# EAGLE design 555 (EAGLE 9.5.1)
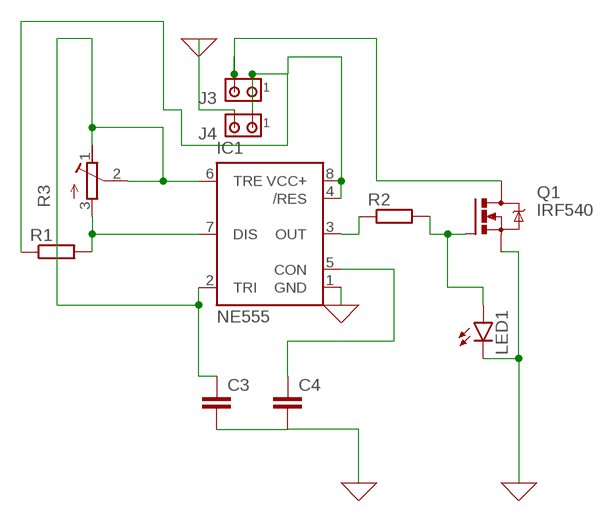
[diagram p0: schematic, sheet 1]

## Parts
C3  C2.5/5  [C2.5-5]
C4  C2.5/5  [C2.5-5]
IC1  NE555  [DIL-08]
J3  MTA02-100  [10X02MTA]
J4  MTA02-100  [10X02MTA]
LED1  LEDSQR2X5  [LED2X5]
Q1  IRF540  [TO220BV]
R1  R-EU_0204/5  [0204/5]
R2  R-EU_0207/7  [0207/7]
R3  R-TRIMMT93XA  [RTRIMT93XA]

## Nets
0: C3.2 C4.2 IC1.1(GND) J4.2 LED1.K(C) Q1.S ; supply symbol labelled GND
N$1: IC1.3(OUT) R2.1
N$2: IC1.4(/RES) IC1.8(VCC+) J3.1 J4.1 R1.1
N$3: LED1.A Q1.G R2.2
N$4: C3.1 IC1.2(TRI) IC1.6(TRE) R3.1(E) R3.2(S)
N$5: IC1.7(DIS) R1.2 R3.3(A)
N$6: C4.1 IC1.5(CON)
N$8: J3.2 Q1.D

## Library data of the parts
C3 C4 = capacitor-wima:C: CAPACITOR naming: grid - package width
IC1 = st-microelectronics:NE555: General purpose bipolar Timer; MF: Arrow Electronics; MPN: NE555N; OC_FARNELL: 1467742; OC_NEWARK: 89K1486
J3 J4 = con-amp:MTA02-100: AMP connector
LED1 = led:LED: LED OSRAM: - CHIPLED LG R971, LG N971, LY N971, LG Q971, LY Q971, LO R971, LY R971 LH N974, LH R974 LS Q976, LO Q976, LY Q976 LO Q996 - Hyper CHIPLED LW Q18S LB Q993, LB Q99A, LB R99A - SideLED LS A670, LO A670, LY A670, LG A670, LP A670 LB A673, LV A673, LT A673, LW A673 LH A674 LY A675 LS A676, LA A676, LO A676, LY A676, LW A676 LS A679, LY A679, LG A679 - Hyper Micro SIDELED® LS Y876, LA Y876, LO Y876, LY Y876 LT Y87S - SmartLED LW L88C, LW L88S LB L89C, LB L89S, LG L890 LS L89K, LO L89K, LY L89K LS L896, LA L896, LO L896, LY L896 - TOPLED LS T670, LO T670, LY T670, LG T670, LP T670 LSG T670, LSP T670, LSY T670, LOP T670, LYG T670 LG T671, LOG T671, LSG T671 LB T673, LV T673, LT T673, LW T673 LH T674 LS T676, LA T676, LO T676, LY T676, LB T676, LH T676, LSB T676, LW T676 LB T67C, LV T67C, LT T67C, LS T67K, LO T67K, LY T67K, LW E67C LS E67B, LA E67B, LO E67B, LY E67B, LB E67C, LV E67C, LT E67C LW T67C LS T679, LY T679, LG T679 LS T770, LO T770, LY T770, LG T770, LP T770 LB T773, LV T773, LT T773, LW T773 LH T774 LS E675, LA E675, LY E675, LS T675 LS T776, LA T776, LO T776, LY T776, LB T776 LHGB T686 LT T68C, LB T68C - Hyper Mini TOPLED® LB M676 - Mini TOPLED Santana® LG M470 LS M47K, LO M47K, LY M47K Source: http://www.osram.convergy.de LUXEON: - LUMILED® LXK2-PW12-R00, LXK2-PW12-S00, LXK2-PW14-U00, LXK2-PW14-V00 LXK2-PM12-R00, LXK2-PM12-S00, LXK2-PM14-U00 LXK2-PE12-Q00, LXK2-PE12-R00, LXK2-PE12-S00, LXK2-PE14-T00, LXK2-PE14-U00 LXK2-PB12-K00, LXK2-PB12-L00, LXK2-PB12-M00, LXK2-PB14-N00, LXK2-PB14-P00, LXK2-PB14-Q00 LXK2-PR12-L00, LXK2-PR12-M00, LXK2-PR14-Q00, LXK2-PR14-R00 LXK2-PD12-Q00, LXK2-PD12-R00, LXK2-PD12-S00 LXK2-PH12-R00, LXK2-PH12-S00 LXK2-PL12-P00, LXK2-PL12-Q00, LXK2-PL12-R00 Source: www.luxeon.com KINGBRIGHT: KA-3528ASYC Source: www.kingbright.com
Q1 = transistor-power:IRF540: HEXFET Power MOSFET
R1 R2 = rcl:R-EU_: RESISTOR, European symbol; SPICEPREFIX: R
R3 = rcl:R-TRIMM: Trimm resistor; SPICEMODEL: X; SPICEPREFIXL: POT

## Board
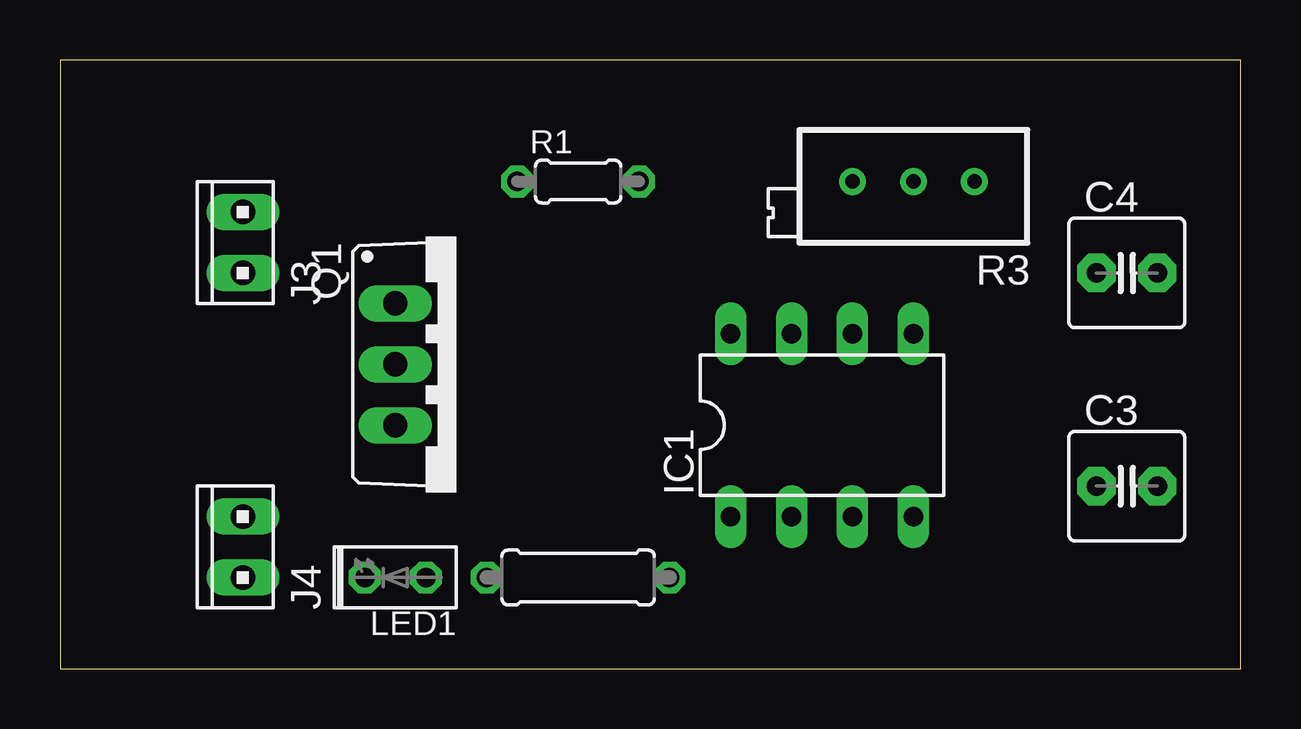
[diagram p1: board, top side]
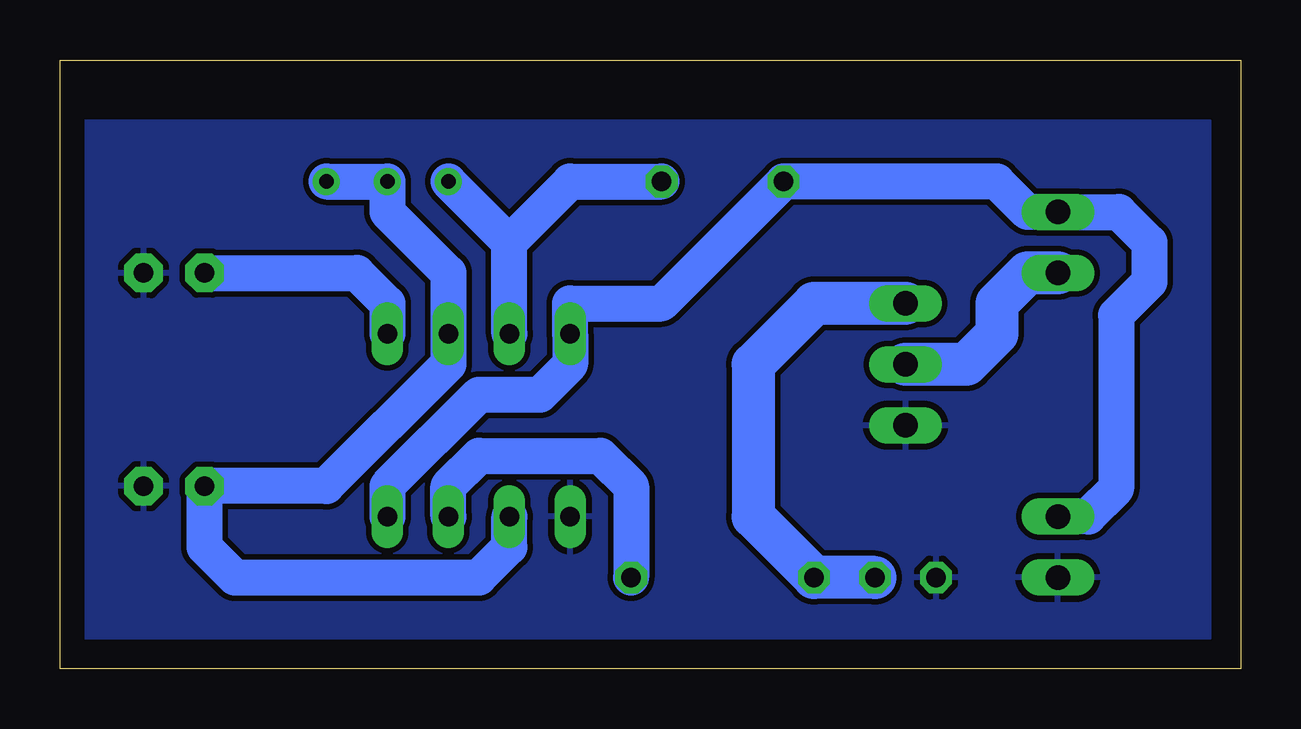
[diagram p2: board, bottom side, seen from below]

Size 49.2 x 25.39 mm. Coordinates in mm from the lower left corner, seen from the top.
Outline: 0,0 49.2,0 49.2,25.39 0,25.39 0,0
Copper layers (1*16): Top 0.035mm / dielectric 1.5mm / Bottom 0.035mm
Design rules "default": minimum track width 6mil, minimum drill 0.35mm, track to track 6mil, track to pad 6mil, pad to pad 6mil, via to via 6mil, smd to smd 6mil, copper to edge 40mil, drill to drill 6mil, minimum pad ring 10mil, minimum via ring 8mil, stop-mask expansion 4mil, vias tented up to drill 0mil, thermal gap 10mil

### Footprints (pad centres in the part's own frame; a part is rotated, then mirrored left to right if it is on the bottom)
C2.5-5 = drill 0.813 pad 1.6 octagon: 1 -1.27,0; 2 1.27,0
DIL-08 = drill 0.813 long: 1 -3.81,-3.81; 2 -1.27,-3.81; 3 1.27,-3.81; 4 3.81,-3.81; 5 3.81,3.81; 6 1.27,3.81; 7 -1.27,3.81; 8 -3.81,3.81
10X02MTA = drill 1.016 long: 1 1.27,0; 2 -1.27,0
LED2X5 = drill 0.813 octagon: A -1.27,0; K 1.27,0
TO220BV = drill 1.016 long: D 0,-2.54; G -2.54,-2.54; S 2.54,-2.54
0204/5 = drill 0.813 octagon: 1 -2.54,0; 2 2.54,0
0207/7 = drill 0.813 octagon: 1 -3.81,0; 2 3.81,0
RTRIMT93XA = drill 0.61: 1 0,-2.54; 2 0,0; 3 0,2.54

### Placement (x,y rotation side)
C3  44.45,7.62 0 top
C4  44.45,16.51 0 top
IC1  31.75,10.16 0 top
J3  7.62,17.78 90 top
J4  7.62,5.08 90 top
LED1  13.97,3.81 180 top
Q1  16.51,12.7 270 top
R1  21.59,20.32 0 top
R2  21.59,3.81 180 top
R3  35.56,20.32 90 top

### Tracks (layer width: path | path; a pad name or v marks a point on that pad's centre or on a via)
0
  pour Bottom (isolate 0.225, rank 6): 1.27,22.86 48.26,22.86 48.26,1.27 1.27,1.27
N$1
  Bottom 1.5: IC1.3 33.02,7.62 31.75,8.89 26.67,8.89 25.4,7.62 R2.1
N$2
  Bottom 1.5: IC1.4 35.56,7.62 31.75,11.43 29.21,11.43 27.94,12.7 IC1.8 27.94,15.24 24.13,15.24 R1.1 10.16,20.32 8.89,19.05 J3.1 5.08,19.05 3.81,17.78 3.81,16.13 5.2,14.75 5.2,7.5 6.35,6.35 J4.1
N$3
  Bottom 1.5: 20.32,6.35 20.32,10.16
  Bottom 1.8: Q1.G 17.78,15.24 20.32,12.7 20.32,6.35 R2.2 LED1.A
N$4
  Bottom 1.5: R3.1 R3.2 35.56,19.05 33.02,16.51 IC1.6 33.02,12.7 38.1,7.62 C3.1 43.18,5.08 41.91,3.81 31.75,3.81 30.48,5.08 IC1.2
N$5
  Bottom 1.5: IC1.7 30.48,17.78 | 30.48,17.78 27.94,20.32 R1.2 | 30.48,17.78 R3.3
N$6
  Bottom 1.5: C4.1 36.83,16.51 35.56,15.24 IC1.5
N$8
  Bottom 1.8: J3.2 8.89,16.51 10.16,15.24 10.16,13.97 11.43,12.7 Q1.D